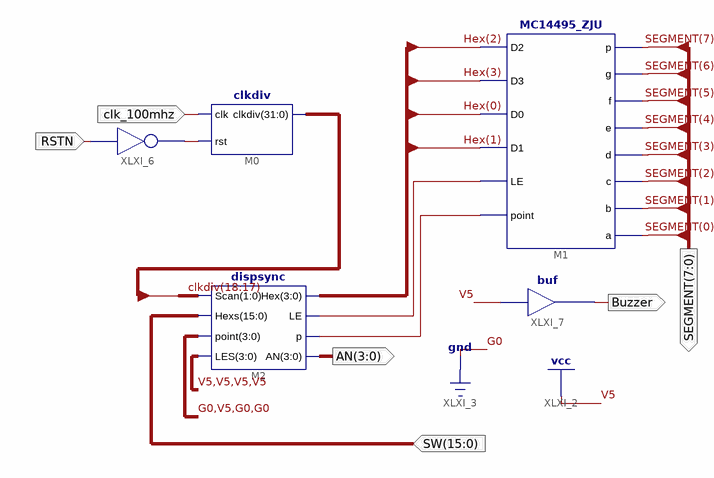
[diagram p0: schematic sheet 1]
// Xilinx ISE schematic Hex427Seg_sch.sch (kintex7) as structural Verilog: 5 symbols, 6 ports
module Hex427Seg_sch (
  input  [15:0] SW,
  input  RSTN,
  input  clk_100mhz,
  output [3:0] AN,
  output [7:0] SEGMENT,
  output Buzzer
);

  wire XLXN_8, XLXN_10, XLXN_19;
  wire [3:0] Hex;
  wire [31:0] clkdiv;

  clkdiv M0 (.clkdiv(clkdiv), .clk(clk_100mhz), .rst(XLXN_19));
  dispsync M2 (
    .LES(4'b1111), .AN(AN), .point(4'b0100), .p(XLXN_10), .Hex(Hex), .Hexs(SW), .Scan(clkdiv[18:17]),
    .LE(XLXN_8));
  not XLXI_6 (XLXN_19, RSTN);
  MC14495_ZJU M1 (
    .D2(Hex[2]), .D3(Hex[3]), .D0(Hex[0]), .D1(Hex[1]), .LE(XLXN_8), .point(XLXN_10), .p(SEGMENT[7]),
    .g(SEGMENT[6]), .f(SEGMENT[5]), .e(SEGMENT[4]), .d(SEGMENT[3]), .c(SEGMENT[2]), .b(SEGMENT[1]),
    .a(SEGMENT[0]));
  buf XLXI_7 (Buzzer, 1'b1);
endmodule
